# Altium project 243-4xx-Suiveur-IR-7.PrjPcb
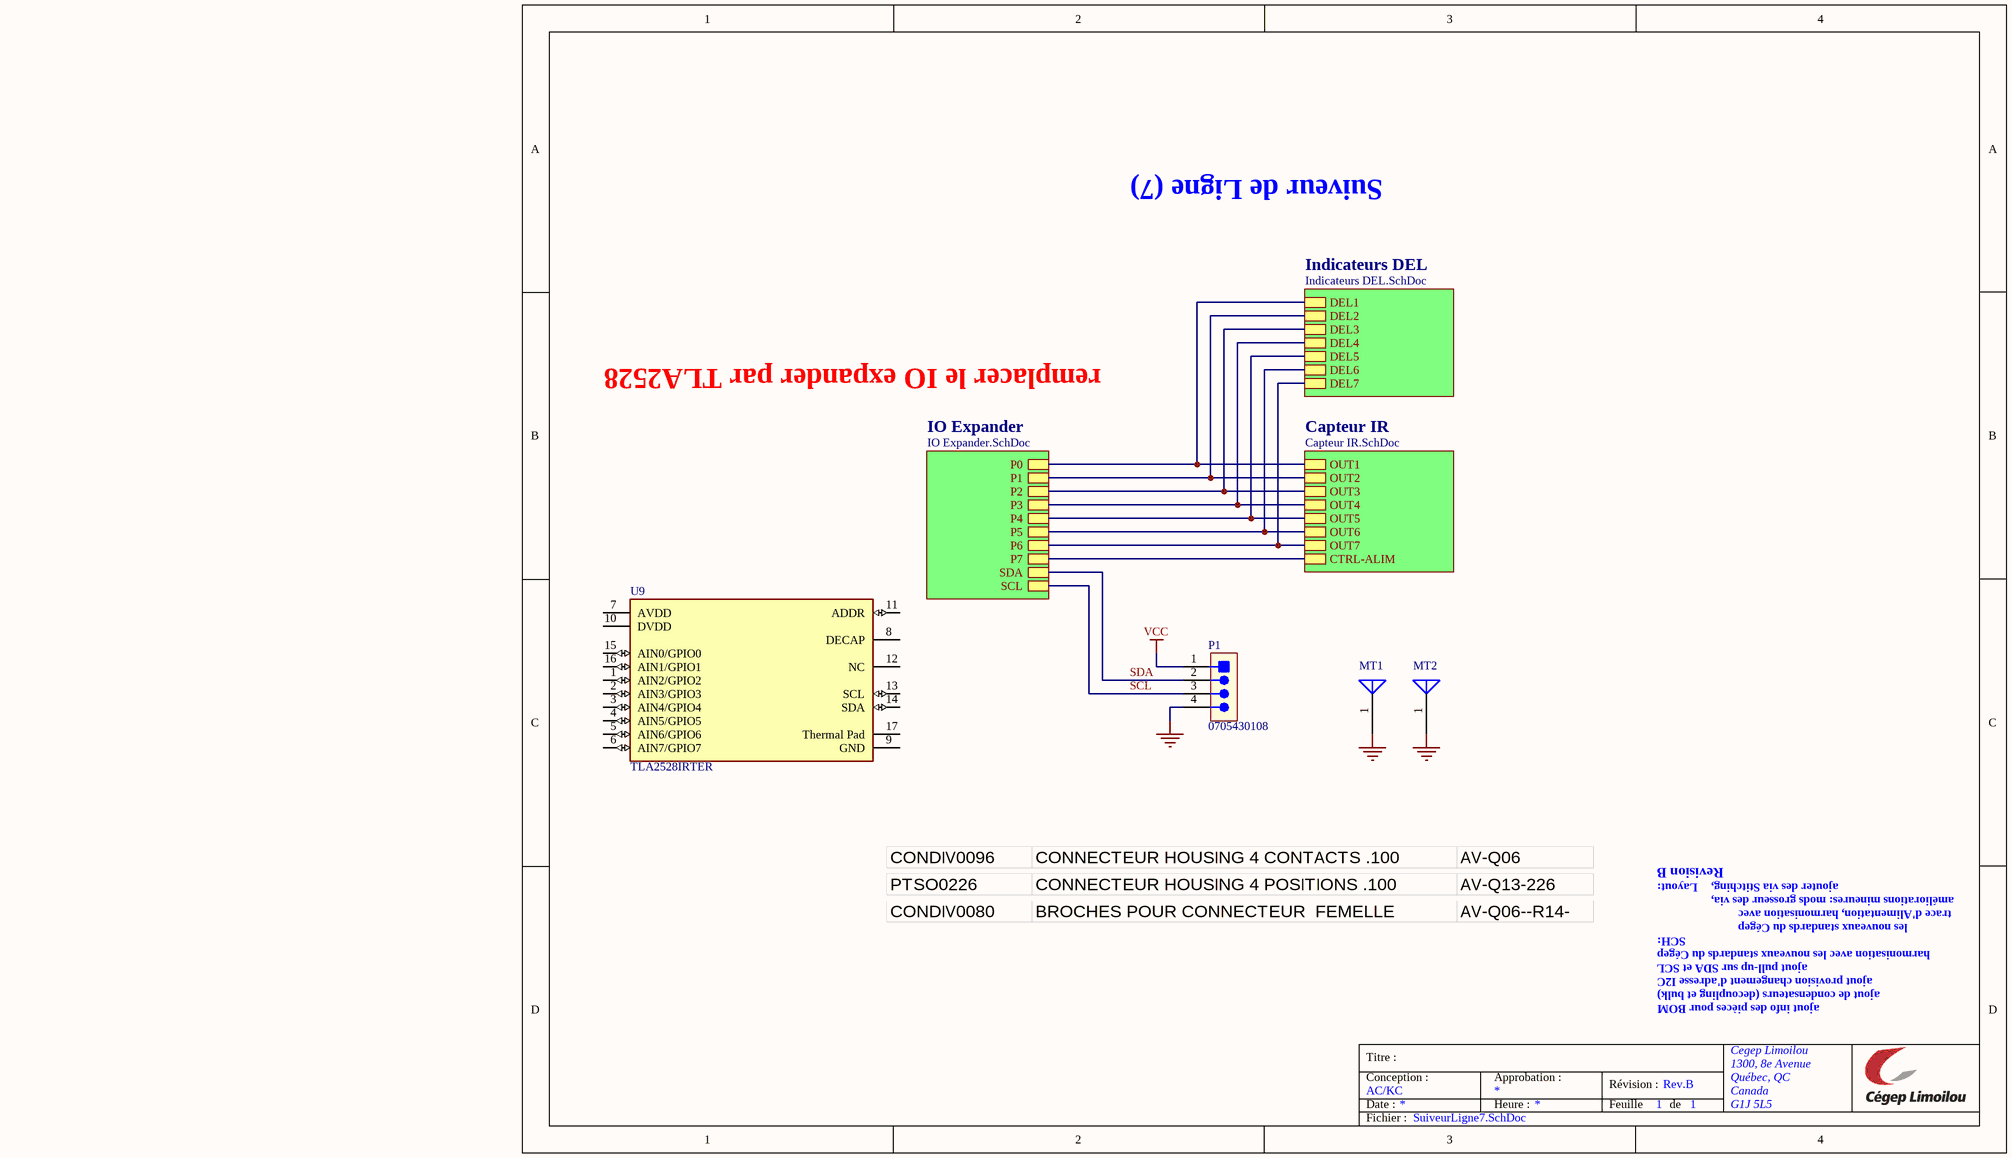
[diagram p0: SuiveurLigne7.SchDoc]
NomDeProjet: Suiveur de Ligne (7); Revision: Rev.B
4 sheets, 61 parts. Net scope: hierarchical (ports join the sheet entries above them; power ports are global).
Board file: 243-4xx-Suiveur-IR-7.PcbDoc
Sheets:
  SuiveurLigne7.SchDoc
    Capteur IR = Capteur IR.SchDoc
    Indicateurs DEL = Indicateurs DEL.SchDoc
    IO Expander = IO Expander.SchDoc

## Sheet SuiveurLigne7.SchDoc: =NomDeProjet
size Letter; Author: AC/KC; Engineer: k.cotton; Organization: Cegep Limoilou; Address1: 1300, 8e Avenue; Address2: Québec, QC; Address3: Canada; Address4: G1J 5L5; SheetNumber: 1; SheetTotal: 1

### Parts
MT1  (no value)  [MTHOLE]  (no BOM)
MT2  (no value)  [MTHOLE]  (no BOM)
P1  0705430108  [MOLEX4]
U9  TLA2528IRTER  [FP-TLA2528IRTER-MFG]

### Sub-sheets
Capteur IR = Capteur IR.SchDoc: OUT1, OUT2, OUT3, OUT4, OUT5, OUT6, OUT7, CTRL-ALIM
Indicateurs DEL = Indicateurs DEL.SchDoc: DEL1, DEL2, DEL3, DEL4, DEL5, DEL6, DEL7
IO Expander = IO Expander.SchDoc: P0, P1, P2, P3, P4, P5, P6, P7, SCL, SDA

### Nets
GND: MT1.1 MT2.1 P1.4
VCC: P1.1
SCL: P1.3 ; sheet IO Expander/SCL
SDA: P1.2 ; sheet IO Expander/SDA
NetQ1_1: sheet Capteur IR/CTRL-ALIM, sheet IO Expander/P7
NetQ2_1: sheet Capteur IR/OUT1, sheet Indicateurs DEL/DEL1, sheet IO Expander/P0
NetQ3_1: sheet Capteur IR/OUT2, sheet Indicateurs DEL/DEL2, sheet IO Expander/P1
NetQ4_1: sheet Capteur IR/OUT3, sheet Indicateurs DEL/DEL3, sheet IO Expander/P2
NetQ5_1: sheet Capteur IR/OUT4, sheet Indicateurs DEL/DEL4, sheet IO Expander/P3
NetQ6_1: sheet Capteur IR/OUT5, sheet Indicateurs DEL/DEL5, sheet IO Expander/P4
NetQ7_1: sheet Capteur IR/OUT6, sheet Indicateurs DEL/DEL6, sheet IO Expander/P5
NetQ8_1: sheet Capteur IR/OUT7, sheet Indicateurs DEL/DEL7, sheet IO Expander/P6

Not connected (* = marked no-connect by the designer): U9 1(AIN2/GPIO2) 2(AIN3/GPIO3) 3(AIN4/GPIO4) 4(AIN5/GPIO5) 5(AIN6/GPIO6) 6(AIN7/GPIO7) 7(AVDD) 8(DECAP) 9(GND) 10(DVDD) 11(ADDR) 12(NC) 13(SCL) 14(SDA) 15(AIN0/GPIO0) 16(AIN1/GPIO1) 17(Thermal_Pad)

### Notes on the sheet
- remplacer le IO expander par TLA2528
- Revision B
- Layout:
- ajouter des via Stitching,
- améliorations mineures: mods grosseur des via,
- SCH:
- harmonisation avec les nouveaux standards du Cégep
- ajout pull-up sur SDA et SCL
- trace d'Alimentation, harmonisation avec
- les nouveaux standards du Cégep
- ajout provision changement d'adresse I2C
- ajout de condensateurs (decoupling et bulk)
- ajout info des pièces pour BOM
- Titre :
- Conception :
- Date :
- Approbation :
- Heure :
- Révision :
- Feuille
- de
- Fichier :

### Library data of the parts
MT1 MT2 = ANTENNA
P1 = CONN-100MIL-HDR-01X04-WIRE-TO-BORAD: CONN HEADER VERT 4POS 2.54MM; Manufacturer 1: CJT; Manufacturer Part Number 1: A2547WV-4P; Code CEGEP: CONDIV089; Localisation: AV-Q06--R14-J057; Supplier 1: LCSC; Supplier Part Number 1: C5224497; Manufacturer 2: Molex; Manufacturer Part Number 2: 0705430108; Supplier 2: Digikey; Supplier Part Number 2: WM4124-ND; Mounting Technology: TH
U9 = CMP-04860-000031-1: SMALL 8-CHANNEL 12-BIT ANALOG-TO; RoHS Compliant: Yes

## Sheet Capteur IR.SchDoc: Capteurs IR
size Letter; Author: AC/KC; Engineer: k.cotton; Organization: Cegep Limoilou; Address1: 1300, 8e Avenue; Address2: Québec, QC; Address3: Canada; Address4: G1J 5L5; SheetNumber: 1; SheetTotal: 1
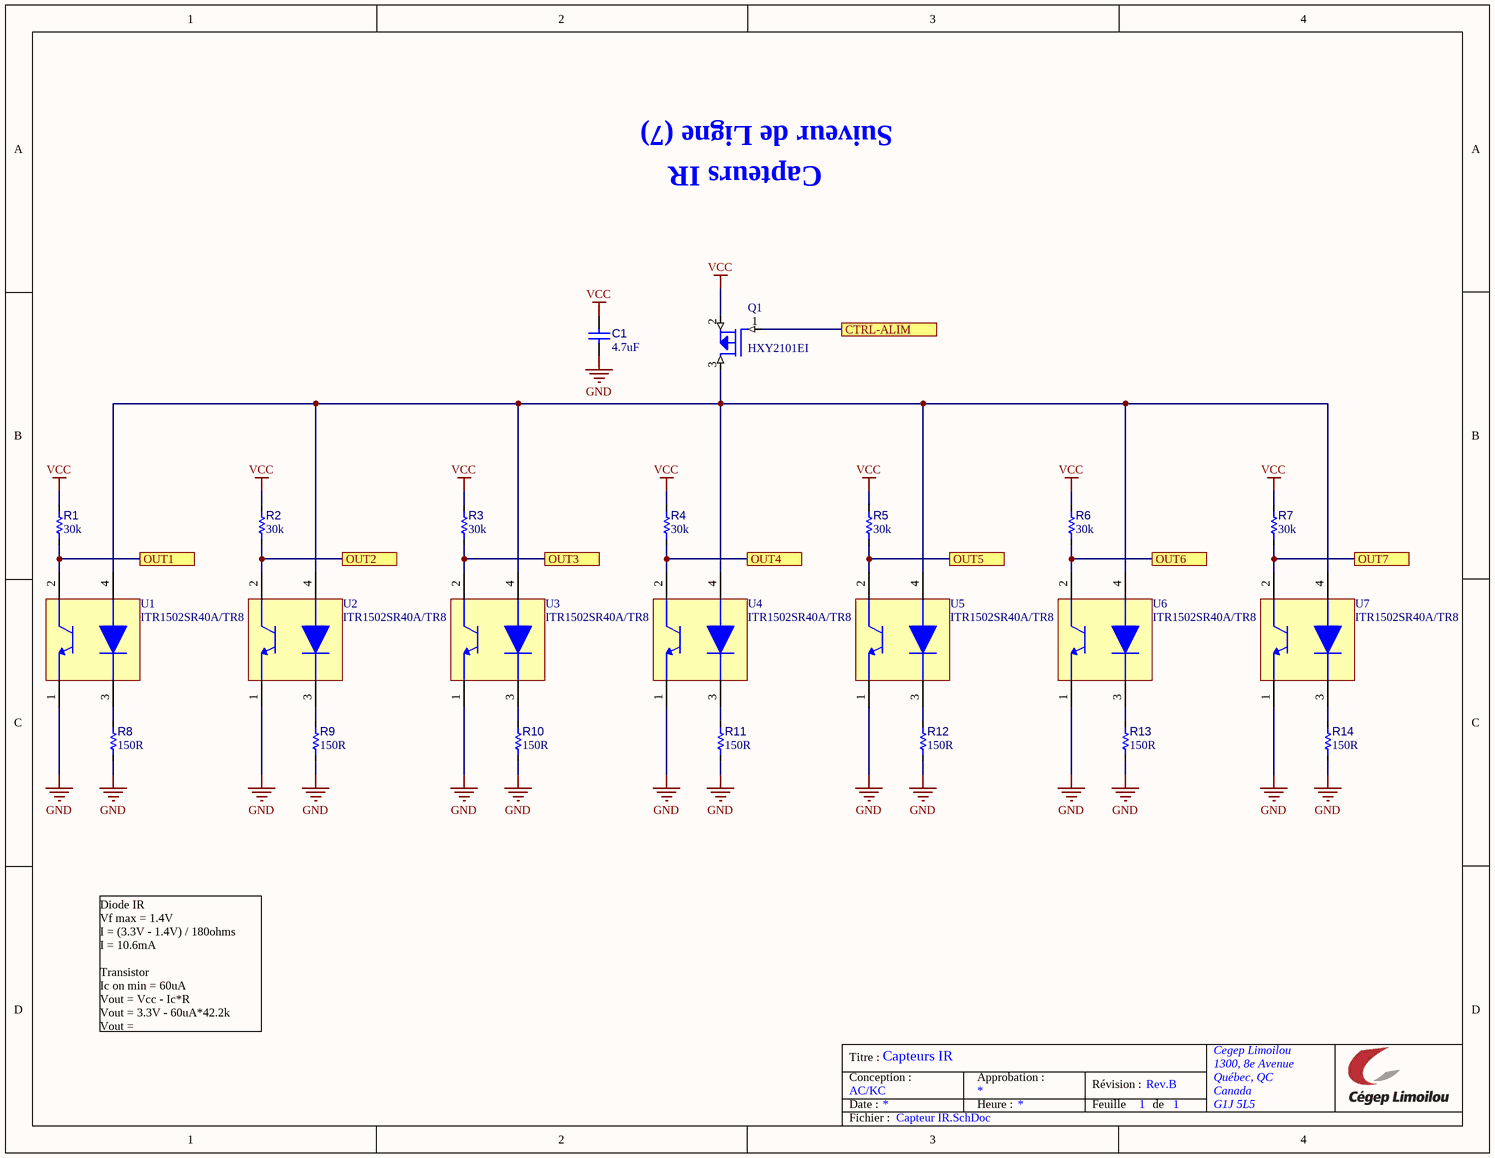
[diagram p1: Capteur IR.SchDoc]

### Parts
C1  value 4.7uF  [C_2012[0805]]  (hidden comment: CAP CER 4.7uF 25V X7R 0805)
Q1  HXY2101EI  [SOT-323]
R1  value 30k  [R_1608[0603]]  (hidden comment: Res 30k 1% 0603)
R2  value 30k  [R_1608[0603]]  (hidden comment: Res 30k 1% 0603)
R3  value 30k  [R_1608[0603]]  (hidden comment: Res 30k 1% 0603)
R4  value 30k  [R_1608[0603]]  (hidden comment: Res 30k 1% 0603)
R5  value 30k  [R_1608[0603]]  (hidden comment: Res 30k 1% 0603)
R6  value 30k  [R_1608[0603]]  (hidden comment: Res 30k 1% 0603)
R7  value 30k  [R_1608[0603]]  (hidden comment: Res 30k 1% 0603)
R8  value 150R  [R_3216[1206]]  (hidden comment: Res 150R 5% 1206)
R9  value 150R  [R_3216[1206]]  (hidden comment: Res 150R 5% 1206)
R10  value 150R  [R_3216[1206]]  (hidden comment: Res 150R 5% 1206)
R11  value 150R  [R_3216[1206]]  (hidden comment: Res 150R 5% 1206)
R12  value 150R  [R_3216[1206]]  (hidden comment: Res 150R 5% 1206)
R13  value 150R  [R_3216[1206]]  (hidden comment: Res 150R 5% 1206)
R14  value 150R  [R_3216[1206]]  (hidden comment: Res 150R 5% 1206)
U1  ITR1502SR40A/TR8  [GP2S700HCP]
U2  ITR1502SR40A/TR8  [GP2S700HCP]
U3  ITR1502SR40A/TR8  [GP2S700HCP]
U4  ITR1502SR40A/TR8  [GP2S700HCP]
U5  ITR1502SR40A/TR8  [GP2S700HCP]
U6  ITR1502SR40A/TR8  [GP2S700HCP]
U7  ITR1502SR40A/TR8  [GP2S700HCP]

### Ports
CTRL-ALIM, OUT1, OUT2, OUT3, OUT4, OUT5, OUT6, OUT7

### Nets
GND: C1.1 R8.1 R9.1 R10.1 R11.1 R12.1 R13.1 R14.1 U1.1(E) U2.1(E) U3.1(E) U4.1(E) U5.1(E) U6.1(E) U7.1(E)
VCC: C1.2 Q1.2(SOURCE) R1.2 R2.2 R3.2 R4.2 R5.2 R6.2 R7.2
NetQ1_1: Q1.1(GATE) ; port CTRL-ALIM
NetQ1_3: Q1.3(DRAIN) U1.4(A) U2.4(A) U3.4(A) U4.4(A) U5.4(A) U6.4(A) U7.4(A)
NetQ2_1: R1.1 U1.2(C) ; port OUT1
NetQ3_1: R2.1 U2.2(C) ; port OUT2
NetQ4_1: R3.1 U3.2(C) ; port OUT3
NetQ5_1: R4.1 U4.2(C) ; port OUT4
NetQ6_1: R5.1 U5.2(C) ; port OUT5
NetQ7_1: R6.1 U6.2(C) ; port OUT6
NetQ8_1: R7.1 U7.2(C) ; port OUT7
NetR8_2: R8.2 U1.3(K)
NetR9_2: R9.2 U2.3(K)
NetR10_2: R10.2 U3.3(K)
NetR11_2: R11.2 U4.3(K)
NetR12_2: R12.2 U5.3(K)
NetR13_2: R13.2 U6.3(K)
NetR14_2: R14.2 U7.3(K)

### Notes on the sheet
- Diode IR
  Vf max = 1.4V
  I = (3.3V - 1.4V) / 180ohms
  I = 10.6mA
  Transistor
  Ic on min = 60uA
  Vout = Vcc - Ic*R
  Vout = 3.3V - 60uA*42.2k
  Vout =
- Titre :
- Conception :
- Date :
- Approbation :
- Heure :
- Révision :
- Feuille
- de
- Fichier :

### Library data of the parts
C1 = CAP003: Capacitor type 1; Manufacturer 1: Taiyo Yuden; Manufacturer Part Number 1: TMK212AB7475KG-T; LibRef: CAP003; Code CEGEP: KCOND02SM; Tolerance: 10%; Rated Voltage: 25V; Dielectric: X7R; Mounting Technology: SMT; Supplier 1: LCSC; Supplier Part Number 1: C163186
Q1 = Q_PMOS-20V-1.8A: MOSFET P-CH 20V 1.8A SOT-323; Manufacturer 1: HXY Mosfet; Manufacturer Part Number 1: HXY2101EI; Supplier 1: LCSC; Supplier Part Number 1: C5148643; Manufacturer 2: MCC; Manufacturer Part Number 2: SI2101A-TP; Supplier 2: Digikey; Supplier Part Number 2: 353-SI2101A-TPCT-ND; Mounting Technology: SMT
R1-R7 = RES030: Resistor type 1; Manufacturer 1: Yageo; Manufacturer Part Number 1: RC0603FR-0730KL; LibRef: RES030; Puissance: 1/10W; Max Working Voltage: 75V; Tolerance: 1%; Mounting Technology: SMT; Supplier 1: LCSC; Supplier Part Number 1: C100001
R8-R14 = RES042: Resistor type 1; LibRef: RES042; Code CEGEP: RESI0045SMT; Localisation: AV-P24--R14-J04; Puissance: 1/4W; Max Working Voltage: 200V; Tolerance: 5%; Mounting Technology: SMT
U1-U7 = U_ITR1502SR40A/TR8: PHOTOINTERRUPTER REFLECTIVE 3MM SMD; Manufacturer 1: Everlight; Manufacturer Part Number 1: ITR1502SR40A/TR8; Supplier 1: LCSC; Supplier Part Number 1: C183793; Manufacturer 2: Sharp; Manufacturer Part Number 2: GP2S700HCP; Supplier 2: Digikey; Supplier Part Number 2: 1855-1020-1-ND; Mounting Technology: SMT

## Sheet Indicateurs DEL.SchDoc: Indicateurs DEL
size Letter; Author: AC/KC; Engineer: k.cotton; Organization: Cegep Limoilou; Address1: 1300, 8e Avenue; Address2: Québec, QC; Address3: Canada; Address4: G1J 5L5; SheetNumber: 1; SheetTotal: 1
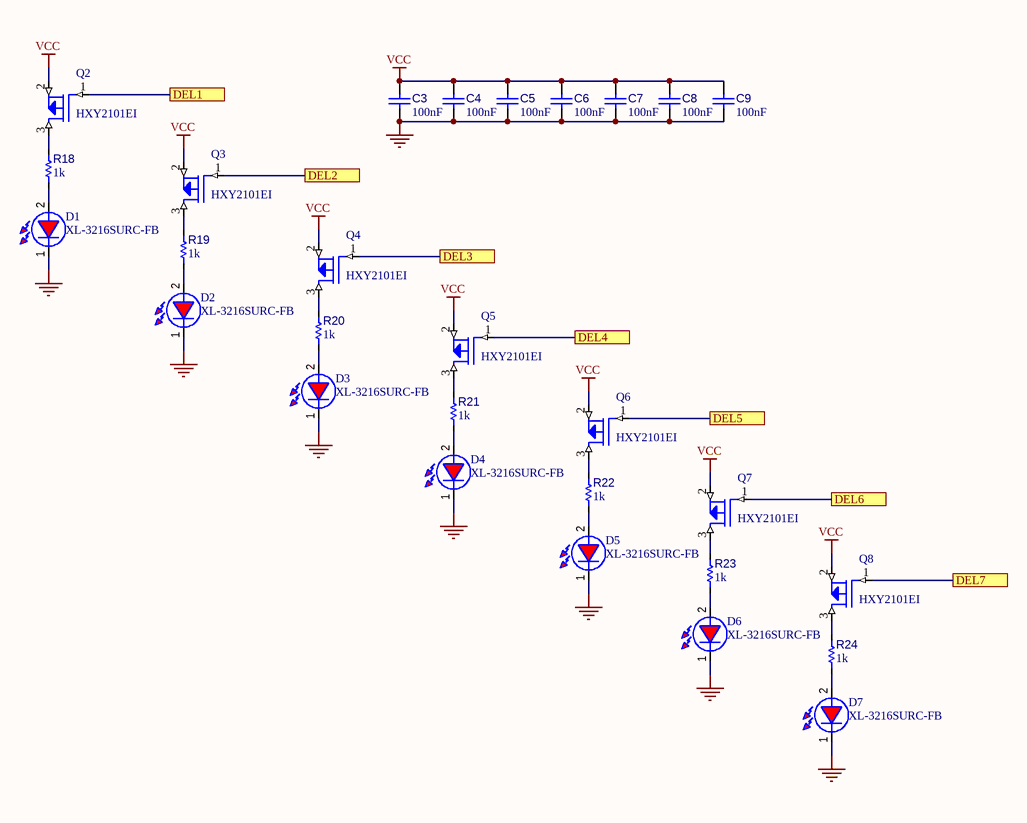
[diagram p2: Indicateurs DEL.SchDoc]

### Parts
C3  value 100nF  [C_1608[0603]]  (hidden comment: CAP CER 100nF 50V 0603)
C4  value 100nF  [C_1608[0603]]  (hidden comment: CAP CER 100nF 50V 0603)
C5  value 100nF  [C_1608[0603]]  (hidden comment: CAP CER 100nF 50V 0603)
C6  value 100nF  [C_1608[0603]]  (hidden comment: CAP CER 100nF 50V 0603)
C7  value 100nF  [C_1608[0603]]  (hidden comment: CAP CER 100nF 50V 0603)
C8  value 100nF  [C_1608[0603]]  (hidden comment: CAP CER 100nF 50V 0603)
C9  value 100nF  [C_1608[0603]]  (hidden comment: CAP CER 100nF 50V 0603)
D1  XL-3216SURC-FB  [LED 1206]
D2  XL-3216SURC-FB  [LED 1206]
D3  XL-3216SURC-FB  [LED 1206]
D4  XL-3216SURC-FB  [LED 1206]
D5  XL-3216SURC-FB  [LED 1206]
D6  XL-3216SURC-FB  [LED 1206]
D7  XL-3216SURC-FB  [LED 1206]
Q2  HXY2101EI  [SOT-323]
Q3  HXY2101EI  [SOT-323]
Q4  HXY2101EI  [SOT-323]
Q5  HXY2101EI  [SOT-323]
Q6  HXY2101EI  [SOT-323]
Q7  HXY2101EI  [SOT-323]
Q8  HXY2101EI  [SOT-323]
R18  value 1k  [R_1608[0603]]  (hidden comment: Res 1k 1% 0603)
R19  value 1k  [R_1608[0603]]  (hidden comment: Res 1k 1% 0603)
R20  value 1k  [R_1608[0603]]  (hidden comment: Res 1k 1% 0603)
R21  value 1k  [R_1608[0603]]  (hidden comment: Res 1k 1% 0603)
R22  value 1k  [R_1608[0603]]  (hidden comment: Res 1k 1% 0603)
R23  value 1k  [R_1608[0603]]  (hidden comment: Res 1k 1% 0603)
R24  value 1k  [R_1608[0603]]  (hidden comment: Res 1k 1% 0603)

### Ports
DEL1, DEL2, DEL3, DEL4, DEL5, DEL6, DEL7

### Nets
GND: C3.1 C4.1 C5.1 C6.1 C7.1 C8.1 C9.1 D1.1(K) D2.1(K) D3.1(K) D4.1(K) D5.1(K) D6.1(K) D7.1(K)
VCC: C3.2 C4.2 C5.2 C6.2 C7.2 C8.2 C9.2 Q2.2(SOURCE) Q3.2(SOURCE) Q4.2(SOURCE) Q5.2(SOURCE) Q6.2(SOURCE) Q7.2(SOURCE) Q8.2(SOURCE)
NetD1_2: D1.2(A) R18.1
NetD2_2: D2.2(A) R19.1
NetD3_2: D3.2(A) R20.1
NetD4_2: D4.2(A) R21.1
NetD5_2: D5.2(A) R22.1
NetD6_2: D6.2(A) R23.1
NetD7_2: D7.2(A) R24.1
NetQ2_1: Q2.1(GATE) ; port DEL1
NetQ2_3: Q2.3(DRAIN) R18.2
NetQ3_1: Q3.1(GATE) ; port DEL2
NetQ3_3: Q3.3(DRAIN) R19.2
NetQ4_1: Q4.1(GATE) ; port DEL3
NetQ4_3: Q4.3(DRAIN) R20.2
NetQ5_1: Q5.1(GATE) ; port DEL4
NetQ5_3: Q5.3(DRAIN) R21.2
NetQ6_1: Q6.1(GATE) ; port DEL5
NetQ6_3: Q6.3(DRAIN) R22.2
NetQ7_1: Q7.1(GATE) ; port DEL6
NetQ7_3: Q7.3(DRAIN) R23.2
NetQ8_1: Q8.1(GATE) ; port DEL7
NetQ8_3: Q8.3(DRAIN) R24.2

### Notes on the sheet
- Titre :
- Conception :
- Date :
- Approbation :
- Heure :
- Révision :
- Feuille
- de
- Fichier :

### Library data of the parts
C3-C9 = CAP002: Capacitor type 1; Manufacturer 1: Yageo; Manufacturer Part Number 1: CC0603KRX7R9BB104; LibRef: CAP002; Code CEGEP: COND0143SM; Tolerance: 10%; Dielectric: X7R; Rated Voltage: 50V; Mounting Technology: SMT; Supplier 1: LCSC; Supplier Part Number 1: C14663
D1-D7 = D_LED_RED_1206: DEL Rouge 1206; Manufacturer 1: XINGLIGHT; Code CEGEP: LEDROUGECLAIR; Localisation: AVP-14; Manufacturer Part Number 1: XL-3216SURC-FB; Supplier 1: LCSC; Supplier Part Number 1: C3646938; Manufacturer 2: Würth Elektronik; Manufacturer Part Number 2: 150120RS75000; Supplier 2: Digikey; Supplier Part Number 2: 732-4991-1-ND; Mounting Technology: SMT
Q2-Q8 = Q_PMOS-20V-1.8A: as Q1 on sheet Capteur IR; Manufacturer Part Number 1: HXY2101EI; Supplier 1: LCSC; Supplier Part Number 1: C5148643; Manufacturer 2: MCC; Manufacturer Part Number 2: SI2101A-TP; Supplier 2: Digikey; Supplier Part Number 2: 353-SI2101A-TPCT-ND; Mounting Technology: SMT
R18-R24 = RES015: Resistor type 1; Manufacturer 1: Yageo; Manufacturer Part Number 1: RC0603FR-071KL; LibRef: RES015; Puissance: 1/10W; Max Working Voltage: 75V; Tolerance: 1%; Mounting Technology: SMT; Supplier 1: LCSC; Supplier Part Number 1: C22548

## Sheet IO Expander.SchDoc: IO Expander
size Letter; Author: AC/KC; Engineer: k.cotton; Organization: Cegep Limoilou; Address1: 1300, 8e Avenue; Address2: Québec, QC; Address3: Canada; Address4: G1J 5L5; SheetNumber: 1; SheetTotal: 1
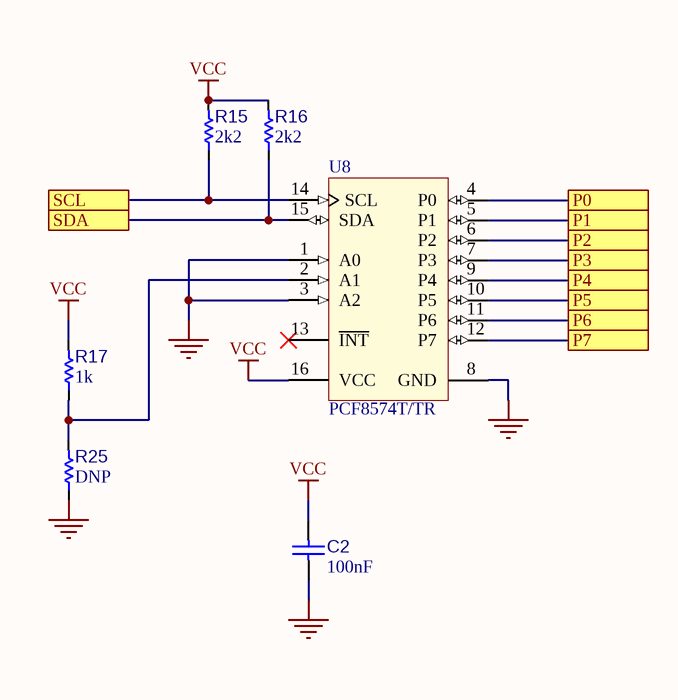
[diagram p3: IO Expander.SchDoc]

### Parts
C2  value 100nF  [C_1608[0603]]  (hidden comment: CAP CER 100nF 50V 0603)
R15  value 2k2  [R_1005[0402]]  (hidden comment: Res 2k2 1% 0402)
R16  value 2k2  [R_1005[0402]]  (hidden comment: Res 2k2 1% 0402)
R17  value 1k  [R_1608[0603]]  (hidden comment: Res 1k 1% 0603)
R25  value DNP  [R_1608[0603]]  (hidden comment: Res 1k 1% 0603)  (no BOM)
U8  PCF8574T/TR  [SOIC127P1030X265-16N]

### Ports
P0, P1, P2, P3, P4, P5, P6, P7, SCL, SDA

### Nets
GND: C2.1 R25.1 U8.1(A0) U8.3(A2) U8.8(GND)
VCC: C2.2 R15.2 R16.2 R17.2 U8.16(VCC)
SCL: R15.1 U8.14(SCL) ; port SCL
SDA: R16.1 U8.15(SDA) ; port SDA
NetQ1_1: U8.12(P7) ; port P7
NetQ2_1: U8.4(P0) ; port P0
NetQ3_1: U8.5(P1) ; port P1
NetQ4_1: U8.6(P2) ; port P2
NetQ5_1: U8.7(P3) ; port P3
NetQ6_1: U8.9(P4) ; port P4
NetQ7_1: U8.10(P5) ; port P5
NetQ8_1: U8.11(P6) ; port P6
NetR17_1: R17.1 R25.2 U8.2(A1)

Not connected (* = marked no-connect by the designer): U8 13(~{INT})*

### Notes on the sheet
- Titre :
- Conception :
- Date :
- Approbation :
- Heure :
- Révision :
- Feuille
- de
- Fichier :

### Library data of the parts
C2 = CAP002: as C3 on sheet Indicateurs DEL; Rated Voltage: 50V; Mounting Technology: SMT; Supplier 1: LCSC; Supplier Part Number 1: C14663
R15 R16 = RES008: Resistor type 1; Manufacturer 1: Yageo; Manufacturer Part Number 1: RC0402FR-072K2L; LibRef: RES008; Code CEGEP: RES2.2KSM; Puissance: 1/16W; Max Working Voltage: 50V; Tolerance: 1%; Mounting Technology: SMT; Supplier 1: LCSC; Supplier Part Number 1: C114762; Supplier 2: Digi-Key; Supplier Part Number 2: 311-2.20KLRCT-ND
R17 R25 = RES015: as R18 on sheet Indicateurs DEL; Tolerance: 1%; Mounting Technology: SMT; Supplier 1: LCSC; Supplier Part Number 1: C22548
U8 = U_PCF8574-SOIC: Remote 8-bit I/O expander for I2C-bus; Manufacturer 1: HG Semi; Code CEGEP: KIC8574SM; Localisation: R13-D030; Manufacturer Part Number 1: PCF8574T/TR; Supplier 1: LCSC; Supplier Part Number 1: C2987288; Manufacturer 2: TI; Manufacturer Part Number 2: PCF8574DWR; Supplier 2: Digikey; Supplier Part Number 2: 296-13108-1-ND; Mounting Technology: SMT

## Nets that join several sheets
GND: SuiveurLigne7 (MT1.1 MT2.1 P1.4), Capteur IR (15 pins), Indicateurs DEL (14 pins), IO Expander (5 pins)
VCC: SuiveurLigne7 (P1.1), Capteur IR (9 pins), Indicateurs DEL (14 pins), IO Expander (5 pins)
NetQ1_1: Capteur IR (Q1.1), IO Expander (U8.12)
NetQ2_1: Capteur IR (R1.1 U1.2), Indicateurs DEL (Q2.1), IO Expander (U8.4)
NetQ3_1: Capteur IR (R2.1 U2.2), Indicateurs DEL (Q3.1), IO Expander (U8.5)
NetQ4_1: Capteur IR (R3.1 U3.2), Indicateurs DEL (Q4.1), IO Expander (U8.6)
NetQ5_1: Capteur IR (R4.1 U4.2), Indicateurs DEL (Q5.1), IO Expander (U8.7)
NetQ6_1: Capteur IR (R5.1 U5.2), Indicateurs DEL (Q6.1), IO Expander (U8.9)
NetQ7_1: Capteur IR (R6.1 U6.2), Indicateurs DEL (Q7.1), IO Expander (U8.10)
NetQ8_1: Capteur IR (R7.1 U7.2), Indicateurs DEL (Q8.1), IO Expander (U8.11)
SCL: SuiveurLigne7 (P1.3), IO Expander (R15.1 U8.14)
SDA: SuiveurLigne7 (P1.2), IO Expander (R16.1 U8.15)

## Assembly variants
IR capteur only - no led indicator: not fitted C3 C4 C5 C6 C7 C8 C9 D1 D2 D3 D4 D5 D6 D7 Q2 Q3 Q4 Q5 Q6 Q7 Q8 R18 R19 R20 R21 R22 R23 R24